# EAGLE design dimmer_V1 (EAGLE 6.1)
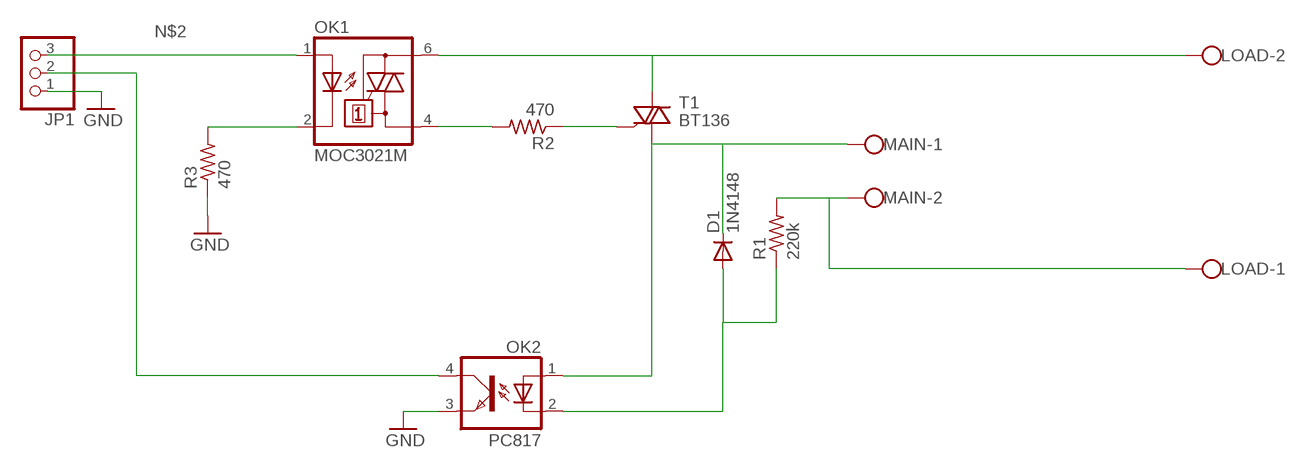
[diagram p0: schematic, sheet 1]

## Parts
D1  1N4148  1N4004  [DO41-10]
JP1  PINHD-1X3  [1X03]
LOAD  W237-102  [W237-102]
MAIN  W237-102  [W237-102]
OK1  MOC3021M  [DIL06]
OK2  PC817  [DIL04]
R1  220k  R-US_0207/10  [0207/10]
R2  470  R-US_0207/10  [0207/10]
R3  470  R-US_0207/10  [0207/10]
T1  BT136  [TO220AB]

## Nets
GND: JP1.1 OK2.3(EMIT) R3.1
N$1: OK1.2(C) R3.2
N$2: JP1.3 OK1.1(A)
N$3: OK1.4(A1) R2.2
N$4: R2.1 T1.3(G)
N$5: LOAD.2 OK1.6(A2) T1.2(A2)
N$6: D1.C MAIN.1 OK2.1(A) T1.1(A1)
N$7: LOAD.1 MAIN.2 R1.2
N$8: D1.A OK2.2(C) R1.1
N$9: JP1.2 OK2.4(COL)

## Library data of the parts
D1 = adafruit:1N4004: DIODE General purpose 1N400x type rectifier (With bigger pads) http://www.ladyada.net/library/pcb/eaglelibrary.html
JP1 = pinhead:PINHD-1X3: PIN HEADER
LOAD MAIN = con-wago-500:W237-102: WAGO SCREW CLAMP; MPN: 237-102; OC_FARNELL: unknown; OC_NEWARK: 70K9898
OK1 = optocoupler:MOC30*M: RANDOM-PHASE OPTOISOLATORS TRIAC DRIVER OUTPUT Source: http://www.fairchildsemi.com MOC3020-M.pdf; MF: FAIRCHILD SEMICONDUCTOR; MPN: MOC3021-M; OC_FARNELL: 1021365; OC_NEWARK: 95B7895
OK2 = optocoupler:PC817: SHARP OPTO COUPLER; MPN: PC817X4J000F; OC_FARNELL: 9707727; OC_NEWARK: 97K7059
R1-R3 = rcl:R-US_: RESISTOR, American symbol
T1 = triac:BT136: Triac BT136 series E sensitive gate Source: http://www.nxp.com/acrobat_download/datasheets/BT136_SERIES_E_2.pdf

## Board
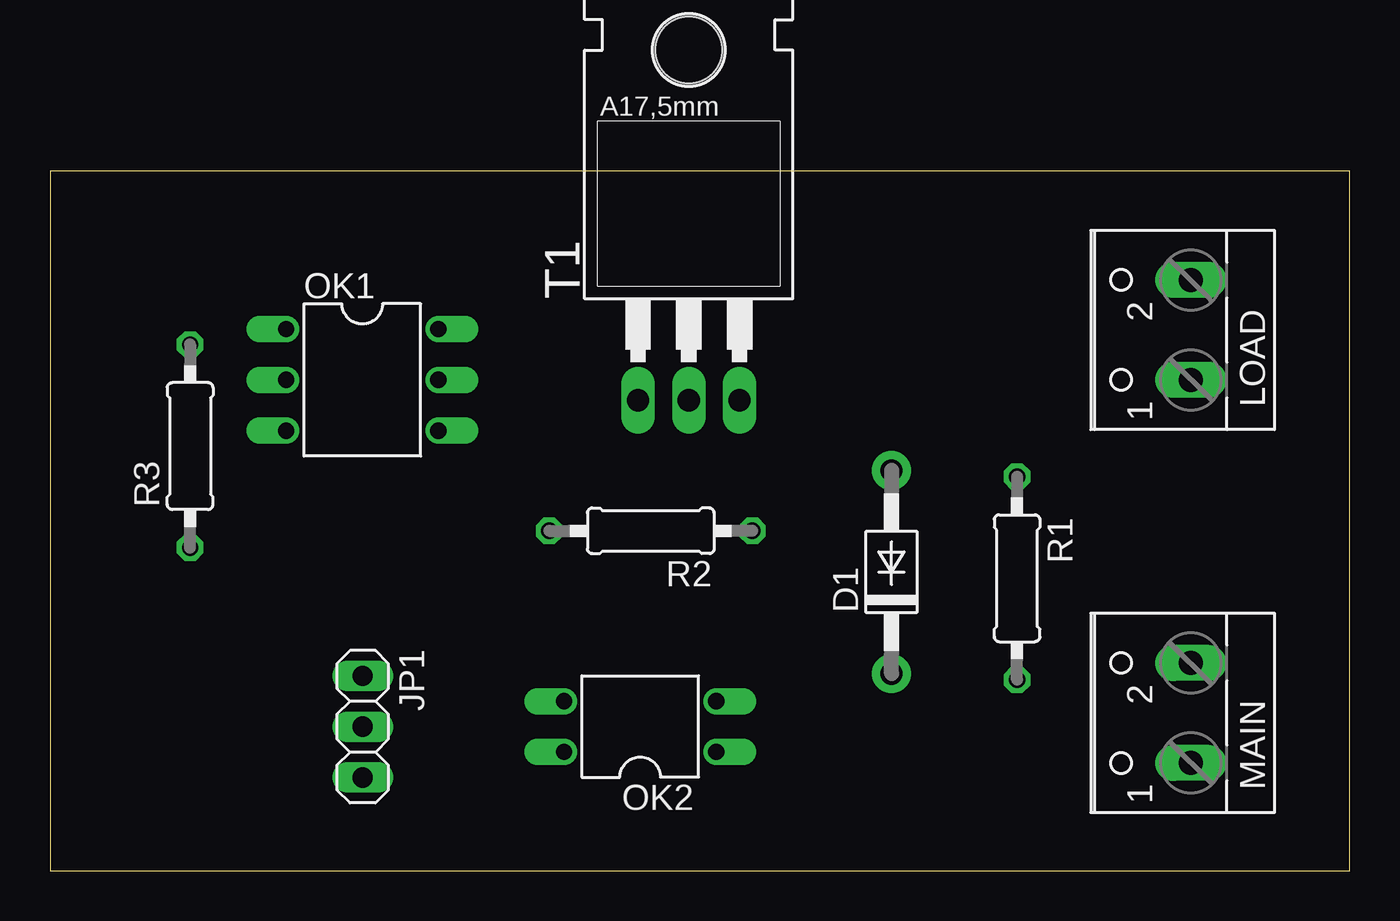
[diagram p1: board, top side]
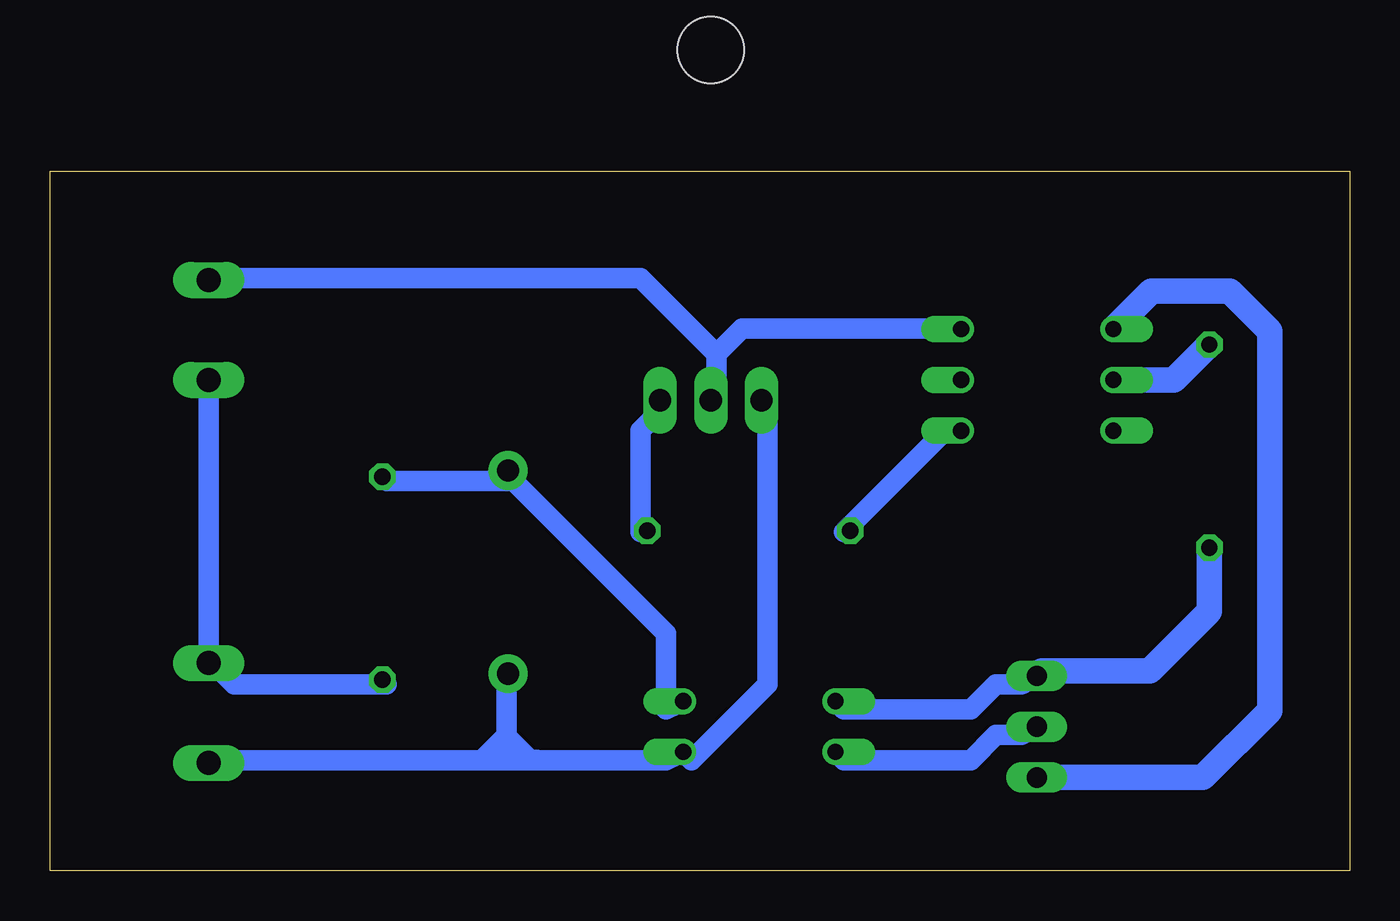
[diagram p2: board, bottom side, seen from below]

Size 65 x 35 mm. Coordinates in mm from the lower left corner, seen from the top.
Outline: 0,0 65,0 65,35 0,35 0,0
Copper layers (1*16): Top 0.035mm / dielectric 1.5mm / Bottom 0.035mm
Design rules: minimum track width 40mil, minimum drill 24mil, track to track 20mil, track to pad 20mil, pad to pad 20mil, via to via 20mil, smd to smd 8mil, copper to edge 40mil, drill to drill 8mil, minimum pad ring 10mil, minimum via ring 8mil, stop-mask expansion 4mil, vias tented up to drill 0mil, thermal gap 10mil

### Footprints (pad centres in the part's own frame; a part is rotated, then mirrored left to right if it is on the bottom)
DO41-10 = drill 1.118 pad 1.93: A 5.08,0; C -5.08,0
1X03 = drill 1.016 long: 1 -2.54,0; 2 0,0; 3 2.54,0
W237-102 = drill 1.194 long: 1 -2.5,-1.27; 2 2.5,-1.27
DIL06 = drill 0.813 offset: 1 -2.54,-3.81; 2 0,-3.81; 3 2.54,-3.81; 4 2.54,3.81; 5 0,3.81; 6 -2.54,3.81
DIL04 = drill 0.813 offset: 1 -1.27,-3.81; 2 1.27,-3.81; 3 1.27,3.81; 4 -1.27,3.81
0207/10 = drill 0.813 octagon: 1 -5.08,0; 2 5.08,0
TO220AB = drill 1.118 long: 1 -2.54,-6.35; 2 0,-6.35; 3 2.54,-6.35 | hole 3.302: 0,11.176

### Placement (x,y rotation side)
D1  42.09,14.95 90 top
JP1  15.64,7.21 270 top
LOAD  55.79,27.06 90 top
MAIN  55.79,7.9 90 top
OK1  15.62,24.56 270 top
OK2  29.52,7.22 90 top
R1  48.37,14.64 270 top
R2  30.05,17.01 180 top
R3  7.01,21.25 90 top
T1  31.95,29.89 0 top

### Tracks (layer width: path | path; a pad name or v marks a point on that pad's centre or on a via)
GND
  Bottom 1.016: OK2.3 25.3,8.07 18.95,8.07 17.68,9.34 16.41,9.34 JP1.1
  Bottom 1.27: R3.1 7.01,12.99 10,10 15.39,10 JP1.1
N$1
  Bottom 1.27: OK1.2 8.78,24.56 R3.2
N$2
  Bottom 1.27: JP1.3 7.33,4.67 4,8 4,27 6,29 9.91,29 OK1.1
N$3
  Bottom 1.016: OK1.4 20.22,22.04 25.3,16.96 R2.2
N$4
  Bottom 1.016: R2.1 35.46,16.96 35.46,22.04 34.19,23.31 T1.3
N$5
  Bottom 1.016: 31.65,25.85 30.38,27.12 20.22,27.12 OK1.6 | 31.65,25.85 31.65,24.58 T1.2 | 31.65,25.85 35.46,29.66 57.05,29.66 LOAD.2
N$6
  Bottom 1.016: T1.1 29.11,23.31 29.11,9.34 32.92,5.53 OK2.1 34.19,5.53 42.17,5.53 | 42.17,5.53 57.06,5.53 MAIN.1 | D1.C 42.17,9.87 42.17,5.53
N$7
  Bottom 1.016: 57.05,10.61 55.78,9.34 48.16,9.34 R1.2 | 57.05,10.61 57.05,24.58 LOAD.1 | 57.05,10.61 MAIN.2
N$8
  Bottom 1.016: 41.81,19.5 34.19,11.88 34.19,8.07 OK2.2 | 41.81,19.5 48.16,19.5 R1.1 | 41.81,19.5 D1.A
N$9
  Bottom 1.016: OK2.4 25.3,5.53 18.95,5.53 17.68,6.8 16.41,6.8 JP1.2
N$10
  Bottom 1.016: 40.64,5.55 41,5.55 42.06,6.62 42.32,6.62 43.26,5.68